# Altium schematic sheet injectors.SchDoc
size A4
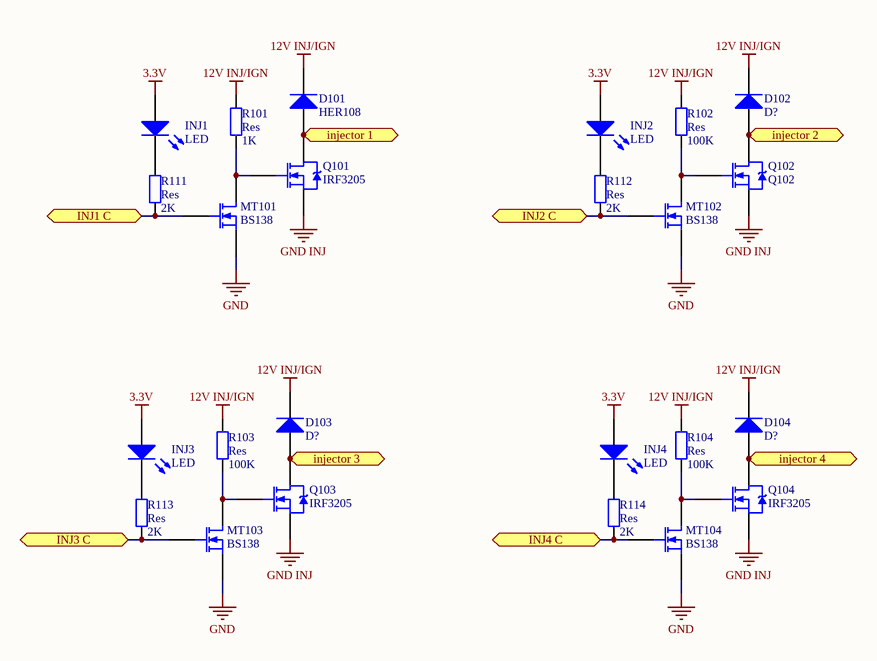
[diagram p0: injectors.SchDoc]

## Parts
D101  HER108  [1N4007]
D102  D?  [1N4007]
D103  D?  [1N4007]
D104  D?  [1N4007]
INJ1  LED  [LED 3mm]
INJ2  LED  [LED 3mm]
INJ3  LED  [LED 3mm]
INJ4  LED  [LED 3mm]
MT101  BS138  [SOT23]
MT102  BS138  [SOT23]
MT103  BS138  [SOT23]
MT104  BS138  [SOT23]
Q101  IRF3205  [TO-220AB]
Q102  Q102  [TO-220AB]
Q103  IRF3205  [TO-220AB]
Q104  IRF3205  [TO-220AB]
R101  Res  value 1K  [1206 footprint]
R102  Res  value 100K  [1206 footprint]
R103  Res  value 100K  [1206 footprint]
R104  Res  value 100K  [1206 footprint]
R111  Res  value 2K  [1206 footprint]
R112  Res  value 2K  [1206 footprint]
R113  Res  value 2K  [1206 footprint]
R114  Res  value 2K  [1206 footprint]

## Ports
INJ1 C (bidir), INJ2 C (bidir), INJ3 C (bidir), INJ4 C (bidir), injector 1 (bidir), injector 2 (bidir), injector 3 (bidir), injector 4 (bidir)

## Nets
3.3V: INJ1.1(A) INJ2.1(A) INJ3.1(A) INJ4.1(A)
12V INJ/IGN: D101.2(K) D102.2(K) D103.2(K) D104.2(K) R101.2 R102.2 R103.2 R104.2
GND: MT101.2(S) MT102.2(S) MT103.2(S) MT104.2(S)
GND INJ: Q101.3(S) Q102.3(S) Q103.3(S) Q104.3(S)
INJ1 C: MT101.1(G) R111.1 ; port INJ1 C
INJ2 C: MT102.1(G) R112.1 ; port INJ2 C
INJ3 C: MT103.1(G) R113.1 ; port INJ3 C
INJ4 C: MT104.1(G) R114.1 ; port INJ4 C
injector 1: D101.1(A) Q101.2(D) ; port injector 1
injector 2: D102.1(A) Q102.2(D) ; port injector 2
injector 3: D103.1(A) Q103.2(D) ; port injector 3
injector 4: D104.1(A) Q104.2(D) ; port injector 4
NetINJ1_2: INJ1.2(K) R111.2
NetINJ2_2: INJ2.2(K) R112.2
NetINJ3_2: INJ3.2(K) R113.2
NetINJ4_2: INJ4.2(K) R114.2
NetMT101_3: MT101.3(D) Q101.1(G) R101.1
NetMT102_3: MT102.3(D) Q102.1(G) R102.1
NetMT103_3: MT103.3(D) Q103.1(G) R103.1
NetMT104_3: MT104.3(D) Q104.1(G) R104.1

## Library data of the parts
D101-D104 = 1N4007
Q101-Q104 = IRF3205: HEXFET Power MOSFET; Note: Pin 2 is electrically connected to pin 4.; Published: 8-Jun-2000; LatestRevisionDate: 17-Jul-2002; LatestRevisionNote: Re-released for DXP Platform.; DatasheetVersion: Aug-1997; PackageVersion: Feb-1997; PackageReference: TO-220AB; Publisher: Altium Limited; PackageDescription: TO, Thru-Hole, Vertical, Heatsink Mounted; 3 In-Line Leads; Pitch 2.54 mm; ComponentLink1Description: Manufacturer Link; ComponentLink1URL: http://www.irf.com/; ComponentLink2Description: Datasheet; ComponentLink2URL: http://www.irf.com/product-info/datasheets/data/irf3205.pdf